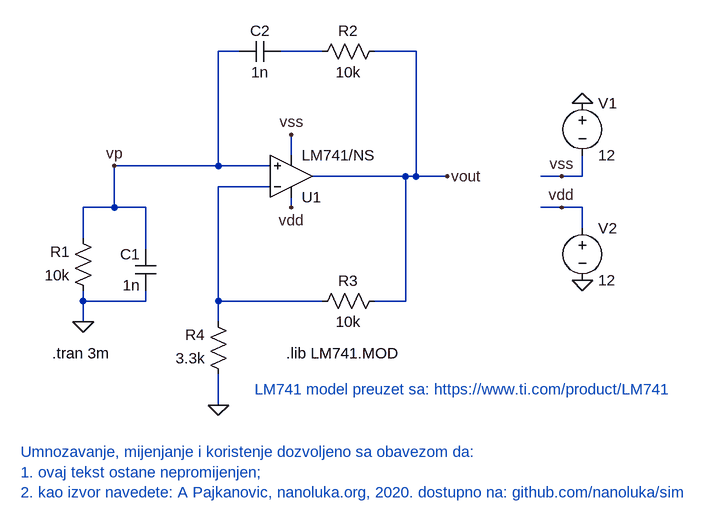
[diagram p0: schematic VinovOscilator.asc]
VinovOscilator.asc, the LTspice schematic file:
Version 4
SHEET 1 880 680
WIRE 64 -96 32 -96
WIRE 192 -96 128 -96
WIRE 336 -96 272 -96
WIRE 144 64 144 32
WIRE 32 80 32 -96
WIRE 32 80 -128 80
WIRE 112 80 32 80
WIRE 320 96 176 96
WIRE 336 96 336 -96
WIRE 336 96 320 96
WIRE 384 96 336 96
WIRE 560 96 528 96
WIRE 592 96 592 64
WIRE 592 96 560 96
WIRE 112 112 32 112
WIRE -128 144 -128 80
WIRE -128 144 -176 144
WIRE -80 144 -128 144
WIRE 144 144 144 128
WIRE 560 144 528 144
WIRE 592 144 560 144
WIRE 592 176 592 144
WIRE -176 192 -176 144
WIRE -80 208 -80 144
WIRE -176 288 -176 272
WIRE -80 288 -80 272
WIRE -80 288 -176 288
WIRE 32 288 32 112
WIRE 192 288 32 288
WIRE 320 288 320 96
WIRE 320 288 272 288
WIRE -176 320 -176 288
WIRE 32 320 32 288
WIRE 32 448 32 400
FLAG -176 320 0
FLAG 32 448 0
FLAG 384 96 vout
FLAG -128 80 vp
FLAG 592 256 0
FLAG 592 -16 0
FLAG 560 144 vdd
FLAG 560 96 vss
FLAG 144 144 vdd
FLAG 144 32 vss
SYMBOL res -160 288 R180
WINDOW 0 36 76 Left 2
WINDOW 3 36 40 Left 2
SYMATTR InstName R1
SYMATTR Value 10k
SYMBOL res 288 -112 R90
WINDOW 0 0 56 VBottom 2
WINDOW 3 32 56 VTop 2
SYMATTR InstName R2
SYMATTR Value 10k
SYMBOL cap -64 272 R180
WINDOW 0 24 56 Left 2
WINDOW 3 24 8 Left 2
SYMATTR InstName C1
SYMATTR Value 1n
SYMBOL cap 128 -112 R90
WINDOW 0 0 32 VBottom 2
WINDOW 3 32 32 VTop 2
SYMATTR InstName C2
SYMATTR Value 1n
SYMBOL res 288 272 R90
WINDOW 0 0 56 VBottom 2
WINDOW 3 32 56 VTop 2
SYMATTR InstName R3
SYMATTR Value 10k
SYMBOL res 48 416 R180
WINDOW 0 36 76 Left 2
WINDOW 3 36 40 Left 2
SYMATTR InstName R4
SYMATTR Value 3.3k
SYMBOL Opamps\\opamp2 144 160 M180
SYMATTR InstName U1
SYMATTR Value LM741/NS
SYMBOL voltage 592 -32 R0
WINDOW 123 0 0 Left 0
WINDOW 39 0 0 Left 0
SYMATTR InstName V1
SYMATTR Value 12
SYMBOL voltage 592 160 R0
WINDOW 123 0 0 Left 0
WINDOW 39 0 0 Left 0
SYMATTR InstName V2
SYMATTR Value 12
TEXT -224 368 Left 2 !.tran 3m
TEXT 136 368 Left 2 !.lib LM741.MOD
TEXT 88 424 Left 2 ;LM741 model preuzet sa: https://www.ti.com/product/LM741
TEXT -272 520 Left 2 ;Umnozavanje, mijenjanje i koristenje dozvoljeno sa obavezom da:\n1. ovaj tekst ostane nepromijenjen;\n2. kao izvor navedete: A Pajkanovic, nanoluka.org, 2020. dostupno na: github.com/nanoluka/sim

The netlist it stands for:
* VinovOscilator.asc
R1 0 vp 10k
R2 vout N001 10k
C1 0 vp 1n
C2 N001 vp 1n
R3 vout N002 10k
R4 0 N002 3.3k
XU1 vp N002 vdd vss vout LM741/NS  ; pins In+ In- V+ V- OUT
V1 0 vss 12
V2 vdd 0 12
.tran 3m
.lib LM741.MOD
* LM741 model preuzet sa: https://www.ti.com/product/LM741
* Umnozavanje, mijenjanje i koristenje dozvoljeno sa obavezom da:
* 1. ovaj tekst ostane nepromijenjen;
* 2. kao izvor navedete: A Pajkanovic, nanoluka.org, 2020. dostupno na: github.com/nanoluka/sim
.backanno
.end